# EAGLE schematic LCmeter0-nokia3310 (EAGLE 7.3.0)
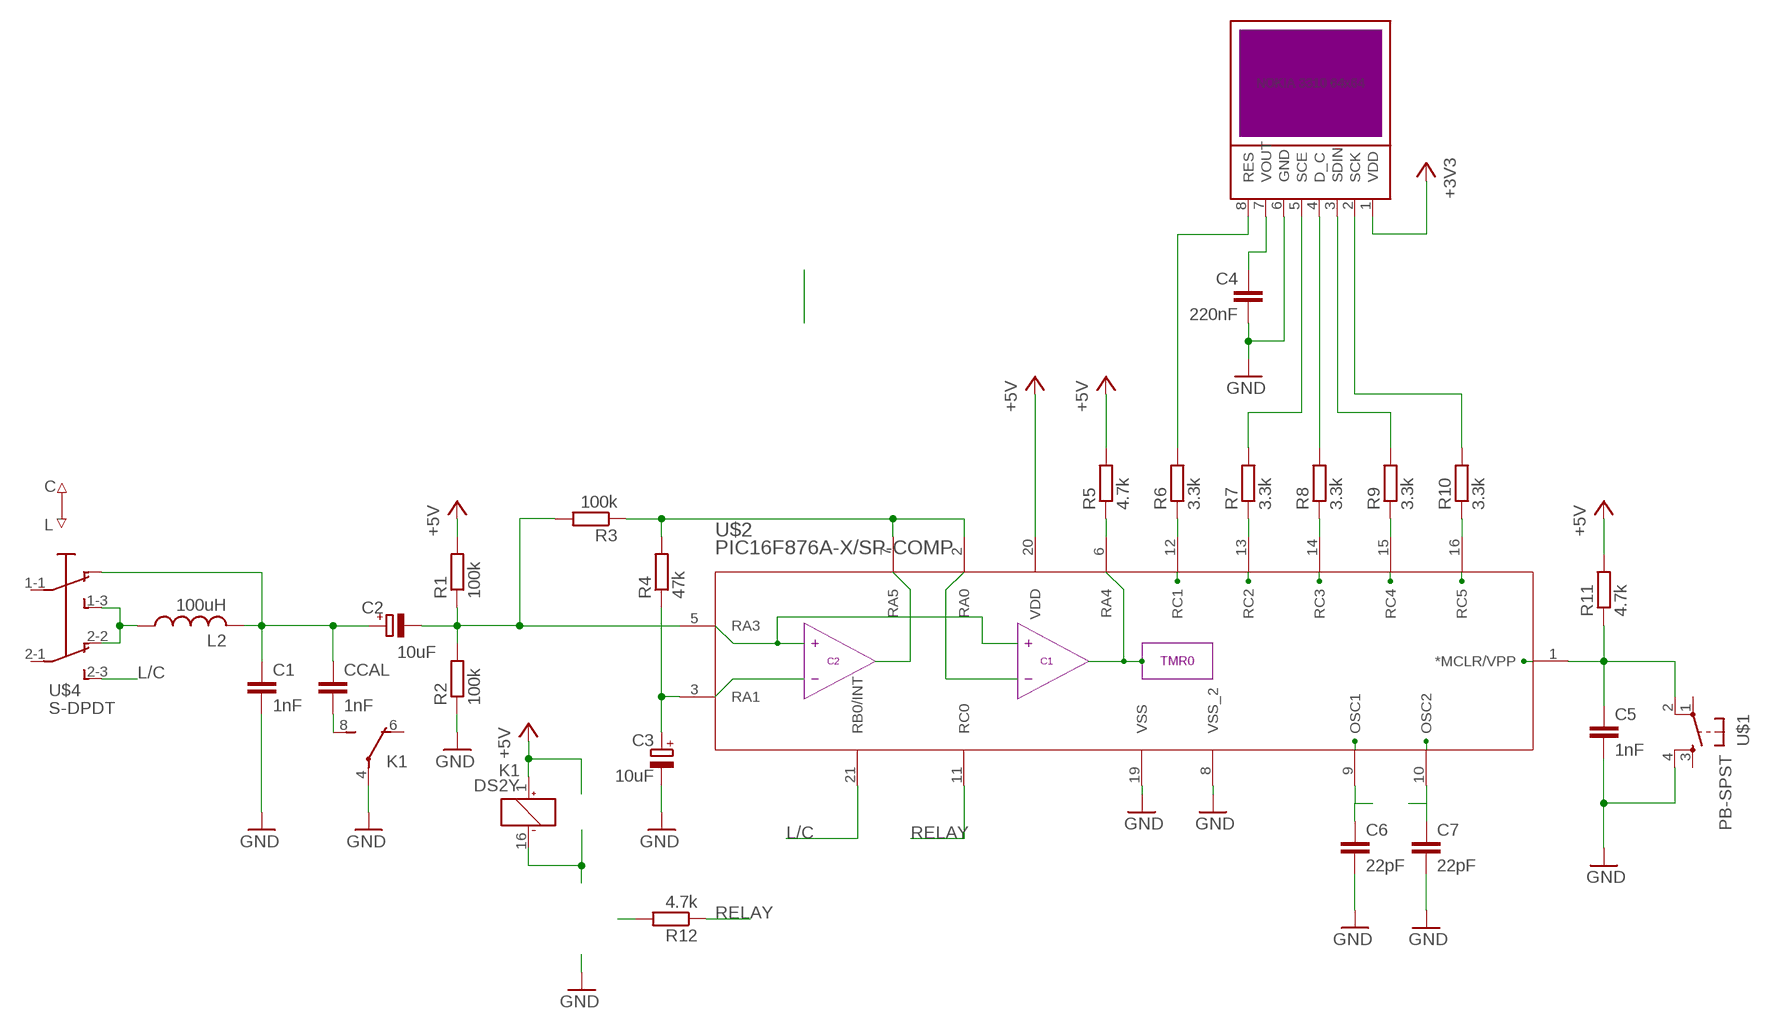
[diagram p0: schematic, sheet 1]

## Parts
C1  1nF  C-EU050-025X075  [C050-025X075]
C2  10uF  CPOL-EUE2.5-5  [E2,5-5]
C3  10uF  CPOL-EUE2.5-5  [E2,5-5]
C4  220nF  C-EU050-025X075  [C050-025X075]
C5  1nF  C-EU050-025X075  [C050-025X075]
C6  22pF  C-EU050-025X075  [C050-025X075]
C7  22pF  C-EU050-025X075  [C050-025X075]
CCAL  1nF  C-EU050-025X075  [C050-025X075]
K1  DS2Y  DS2Y-S-DC5V  [DS2Y]
L2  100uH  L-USIR-2  [IR-2]
R1  100k  R-EU_0204/7  [0204/7]
R2  100k  R-EU_0204/2V  [0204V]
R3  100k  R-EU_0204/7  [0204/7]
R4  47k  R-EU_0204/2V  [0204V]
R5  4.7k  R-EU_0204/7  [0204/7]
R6  3.3k  R-EU_0207/10  [0207/10]
R7  3.3k  R-EU_0207/10  [0207/10]
R8  3.3k  R-EU_0207/10  [0207/10]
R9  3.3k  R-EU_0207/10  [0207/10]
R10  3.3k  R-EU_0207/10  [0207/10]
R11  4.7k  R-EU_0204/2V  [0204V]
R12  4.7k  R-EU_0204/7  [0204/7]
U$1  PB-SPST  [PB-5]
U$2  PIC16F876A-X/SP-COMP  [DIL28-3]
U$3  NOKIA-3310-64X64  [1X8]
U$4  S-DPDT  [DPDT]

## Nets
+3V3: U$3.1(VDD)
+5V: D1.C K1.1(1:+) R1.2 R5.2 R11.2 U$2.20(VDD)
GND: C1.2 C3.- C4.2 C5.2 C6.2 C7.2 K1.4(2:P) R2.1 T1.E U$1.4(S1) U$2.8(VSS_2) U$2.19(VSS) U$3.6(GND)
L/C: U$2.21(RB0/INT) U$4.2-3
N$1: R6.1 U$2.12(RC1)
N$2: R7.1 U$2.13(RC2)
N$3: R8.1 U$2.14(RC3)
N$4: R9.1 U$2.15(RC4)
N$5: R10.1 U$2.16(RC5)
N$6: R5.1 U$2.6(RA4)
N$8: C5.1 R11.1 U$1.2(P1) U$2.1(*MCLR/VPP)
N$9: C7.1 Q1.2 U$2.10(OSC2)
N$10: C6.1 Q1.1 U$2.9(OSC1)
N$11: R10.2 U$3.2(SCK)
N$12: R9.2 U$3.3(SDIN)
N$13: R8.2 U$3.4(D_C)
N$14: R7.2 U$3.5(SCE)
N$15: R6.2 U$3.8(RES)
N$16: C4.1 U$3.7(VOUT)
N$17: R3.1 R4.2 U$2.2(RA0) U$2.7(RA5)
N$19: R12.2 T1.B
N$20: D1.A K1.16(1:-) T1.C
N$21: CCAL.2 K1.8(2:S)
N$23: C1.1 C2.+ CCAL.1 L2.2 U$4.1-2
N$24: L2.1 U$4.1-3 U$4.2-2
RA1: C3.+ R4.1 U$2.3(RA1)
RA3: C2.- R1.1 R2.2 R3.2 U$2.5(RA3)
RELAY: R12.1 U$2.11(RC0)
Unconnected: K1.6(2:O) K1.9(3:S) K1.11(3:O) K1.13(3:P) U$1.1(P) U$1.3(S) U$4.1-1 U$4.2-1

## Notes on the sheet
- C
- L

## Library data of the parts
C1 C4-C7 CCAL = rcl:C-EU: CAPACITOR, European symbol
C2 C3 = rcl:CPOL-EU: POLARIZED CAPACITOR, European symbol
K1 = relay:DS2Y-S-DC*: MINIATURE RELAY NAiS Source: http://www.mew-europe.com/.. en_ds_61005_0023.pdf; MPN: DS2Y-S-DC5V; OC_FARNELL: unknown; OC_NEWARK: 13P3268
L2 = rcl:L-US: INDUCTOR, American symbol
R1-R12 = rcl:R-EU_: RESISTOR, European symbol
U$1 = mcu:PB-SPST
U$2 = mcu:PIC16F876A-X/SP-COMP
U$3 = mcu:NOKIA-3310-64X64
U$4 = mcu:S-DPDT